# EAGLE design YOTSUBA_+Y+Z_ver.1.1b (EAGLE 9.6.2)
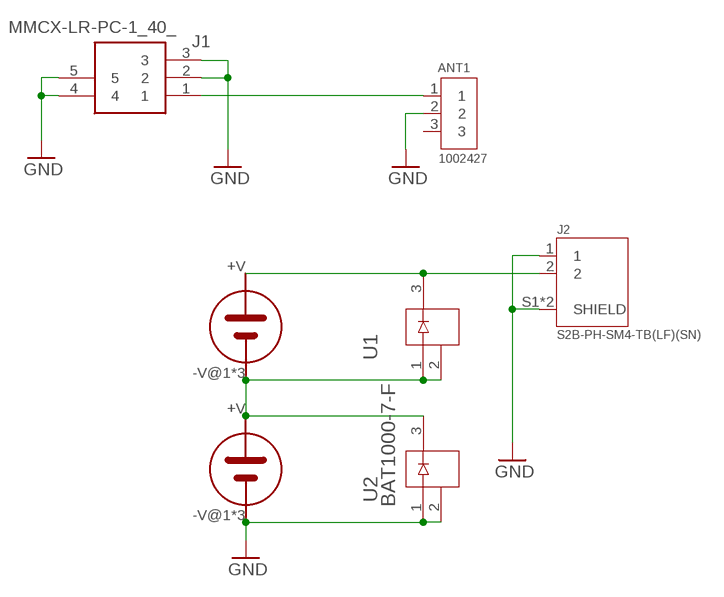
[diagram p0: schematic, sheet 1]

## Parts
ANT1  1002427  [ANTENNA_1002427]
J1  MMCX-LR-PC-1_40_  [MMCXLRPC140]
J2  S2B-PH-SM4-TB(LF)(SN)  [JST_S2B-PH-SM4-TB(LF)(SN)]
U1  BAT1000-7-F  [SOT23_BAT_DIO]
U2  BAT1000-7-F  [SOT23_BAT_DIO]
U$2  3G30A  [SOLAR_3G30A]
U$3  3G30A  [SOLAR_3G30A]

## Nets
GND [GND]: ANT1.2 J1.2 J1.3 J1.4 J1.5 J2.1 J2.S1(SHIELD) J2.S2(SHIELD) U2.1 U2.2 U$3.-V@1(-V) U$3.-V@2(-V) U$3.-V@3(-V)
N$5: U1.1 U1.2 U2.3 U$2.-V@1(-V) U$2.-V@2(-V) U$2.-V@3(-V) U$3.+V
N$6: J2.2 U1.3 U$2.+V
RF2 [ANTENNA]: ANT1.1 J1.1
Unconnected: ANT1.3

## Library data of the parts
ANT1 = 1002427:1002427: RF ANT 868MHZ/915MHZ STAMPED MET; DESCRIPTION: 868MHz, 915MHz, 1.575GHz Beidou, GLONASS, GPS, ISM, LoRa, LPWAN, Sigfox Stamped Metal RF Antenna 868MHz, 915MHz, 1.561GHz ~ 1.602GHz 3dBi Solder Surface Mount; DIGI-KEY_PART_NUMBER: 478-1002427TR-ND; MF: Ethertronics/AVX; MP: 1002427; PACKAGE: None; PURCHASE-URL: https://pricing.snapeda.com/search/part/1002427/?ref=eda
J1 = MMCX-LR-PC-1_40_:MMCX-LR-PC-1_40_: RF Connectors / Coaxial Connectors MINI PUSH-ON CONN RECEPT RA Source: Datasheet <https://componentsearchengine.com/Datasheets/1/MMCX-LR-PC-1(40).pdf>; DESCRIPTION: RF Connectors / Coaxial Connectors MINI PUSH-ON CONN RECEPT RA; HEIGHT: 3.95mm; MANUFACTURER_NAME: Hirose; MANUFACTURER_PART_NUMBER: MMCX-LR-PC-1(40); MOUSER_PART_NUMBER: 798-MMCX-LR-PC-1(40); MOUSER_PRICE-STOCK: https://www.mouser.co.uk/ProductDetail/Hirose-Connector/MMCX-LR-PC-140?qs=XQjbzJWzFPVvtPijmLd%2FXQ%3D%3D
J2 = S2B-PH-SM4-TB_LF__SN_:S2B-PH-SM4-TB(LF)(SN): PH Series 2 Position 2 mm Pitch Surface Mount Side Entry Shrouded Header; DESCRIPTION: Connector Header Surface Mount, Right Angle 2 position 0.079 (2.00mm); DIGI-KEY_PART_NUMBER: 455-1749-2-ND; MF: JST Sales; MP: S2B-PH-SM4-TB(LF)(SN); PACKAGE: None; PURCHASE-URL: https://pricing.snapeda.com/search/part/S2B-PH-SM4-TB(LF)(SN)/?ref=eda
U1 U2 = BAT1000:BAT1000-7-F; COPYRIGHT: Copyright (C) 2023 Ultra Librarian. All rights reserved.; DIGIKEY_PART_NUMBER_1: BAT1000-7FDITR-ND; DIGIKEY_PART_NUMBER_2: BAT1000-7FDICT-ND; DIGIKEY_PART_NUMBER_3: BAT1000-7FDIDKR-ND; MANUFACTURER_PART_NUMBER: BAT1000-7-F; MFR_NAME: Diodes Inc
U$2 U$3 = 3G30A_normal:3G30A

## Net classes
2 GND: clearance 0.5 mm to class 0, clearance 0.21 mm to class 1, clearance 0.5 mm

## Board
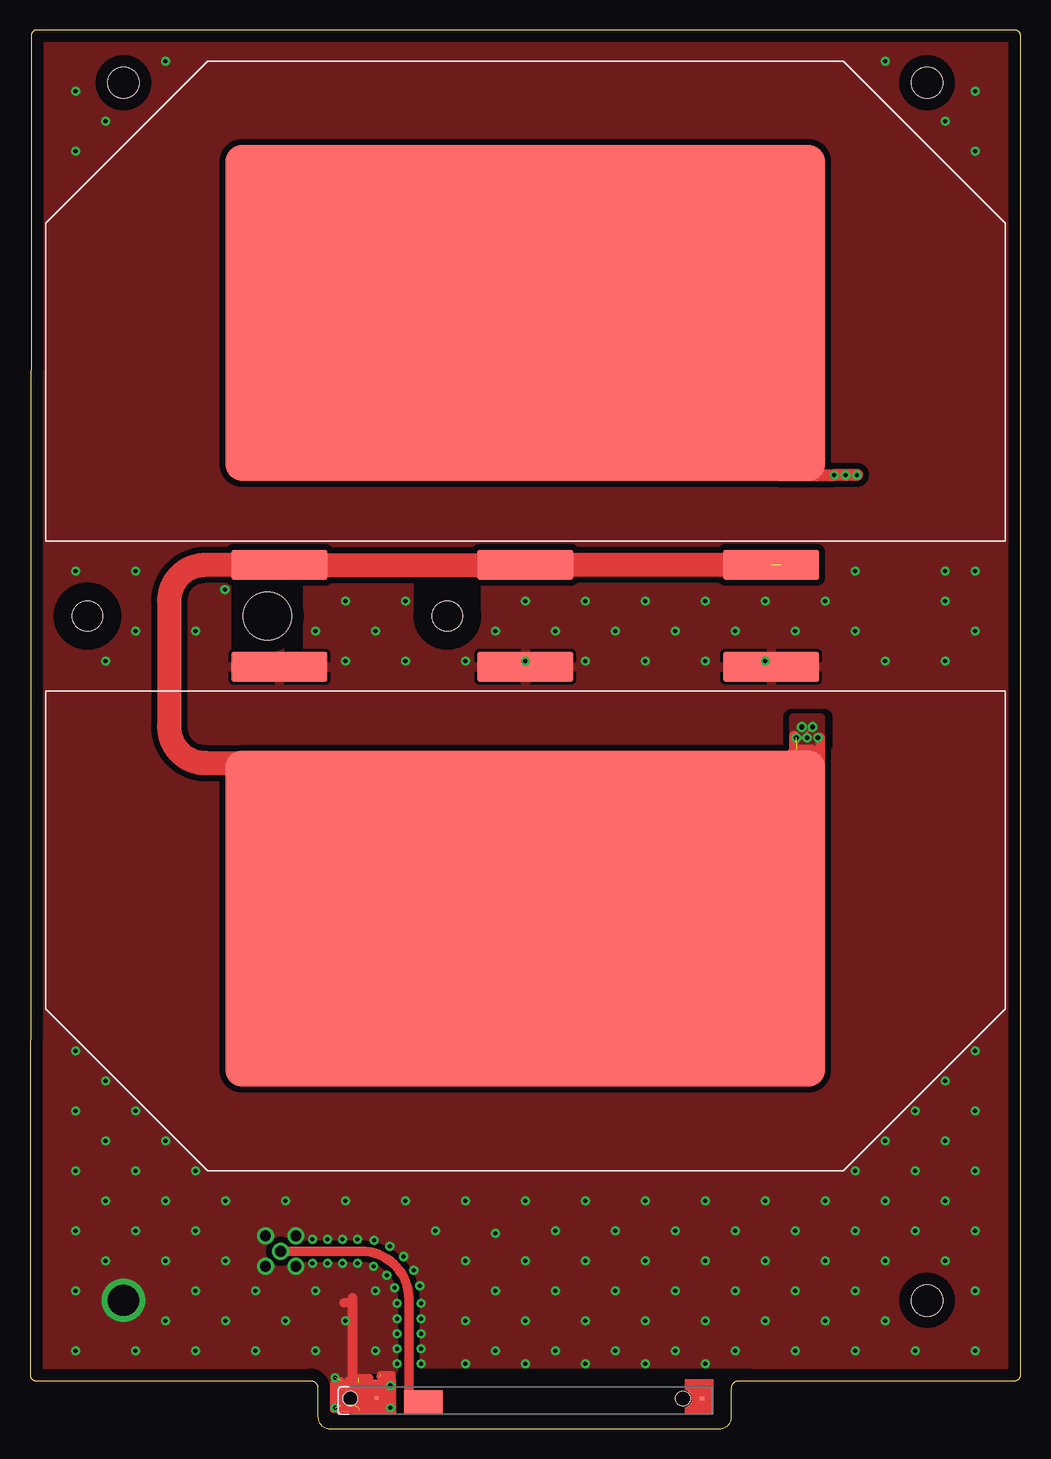
[diagram p1: board, top side]
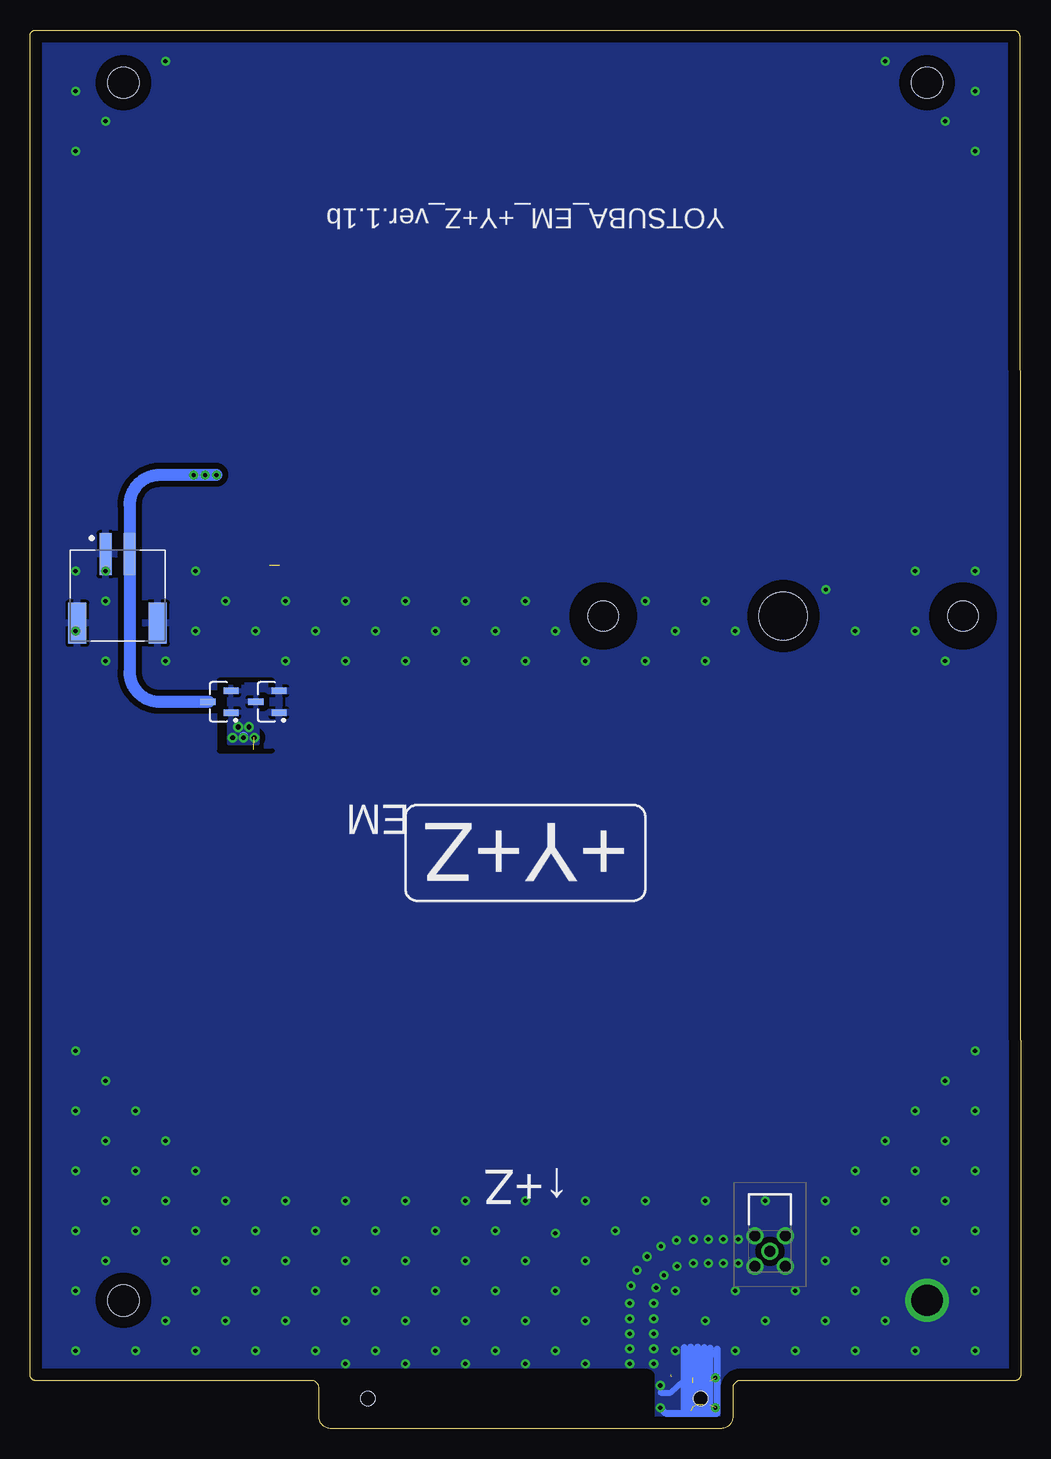
[diagram p2: board, bottom side, seen from below]

Size 82.6 x 116.6 mm. Coordinates in mm from the lower left corner, seen from the top.
Outline: 0.5,4 23.4,4 arc-90 24,3.4 24,1 arc90 25,0 57.5,0 arc90 58.5,1 58.5,3.4 arc-90 59.1,4 82.1,4 arc90 82.6,4.5 82.6,116.1 arc90 82.1,116.6 0.6,116.6 arc90 0.1,116.1 0,4.5 arc90 0.5,4
Copper layers (1*16): Top 0.035mm / dielectric 1.2mm / Bottom 0.035mm
Design rules "default *": minimum track width 6mil, minimum drill 0.35mm, track to track 6mil, track to pad 6mil, pad to pad 6mil, via to via 6mil, smd to smd 6mil, copper to edge 1mm, drill to drill 6mil, minimum pad ring 10mil, minimum via ring 8mil, stop-mask expansion 4mil, vias tented up to drill 30mil, thermal gap 10mil
Holes 2.6 mm at 74.8,10.7 7.8,112.2 74.8,112.2
Holes 4 mm at 19.8,67.75
Holes 2.5 mm at 4.8,67.75 34.8,67.75
tRestrict: area 2.1,65 to 7.5,70.5; area 32.1,65 to 37.5,70.5; 13 lines
bRestrict: area 2.1,65 to 7.5,70.5; area 32.1,65 to 37.5,70.5; 7 lines

### Footprints (pad centres in the part's own frame; a part is rotated, then mirrored left to right if it is on the bottom)
ANTENNA_1002427 = smd 3.2 x 1.9: 1 24.1,-1.05 | smd 0.3 x 0.3: 2 28.02,-1.375; 3 0.875,-1.325 | hole 1.2: 2.46,-1.3; 30.2,-1.3
MMCXLRPC140 = drill 0.9 pad 1.4: 1 0,0; 2 -1.27,-1.27; 3 1.27,-1.27; 4 1.27,1.27; 5 -1.27,1.27
JST_S2B-PH-SM4-TB(LF)(SN) = smd 1 x 3.5: 1 -1,0; 2 1,0 | smd 1.5 x 3.4: S1 -3.35,-5.75; S2 3.35,-5.75
SOT23_BAT_DIO = smd 0.568 x 1.259: 1 -0.915,-0.965; 2 0.915,-0.965; 3 0,0.965
SOLAR_3G30A = smd 50 x 28: +V 0,19 | smd 8 x 2.5: -V@1 -20.5,-2; -V@2 20.5,-2; -V@3 0,-2

### Placement (x,y rotation side)
ANT1  56.9,1.2 180 top
J1  20.9,14.8 90 bottom
J2  75.3,72.9 0 bottom
U1  66.8,60.6 90 bottom
U2  62.8,60.6 90 bottom
U$2  41.3,74 0 top
U$3  41.3,61.5 180 top

### Tracks (layer width: path | path; a pad name or v marks a point on that pad's centre or on a via)
GND  (via drill 0.35, 2.6)  (7 unrouted)
  Top 0.6: ANT1.2 29.4,2.58 29.4,1.75 v30.05,1.75 | v30.05,1.75 29.9,1.6 25.3,1.6 25.3,3.65 | 25.9,1.95 25.9,4 | 26.5,2 26.5,4.05 | 27,2 27,4.05 | 27.35,1.8 27.35,3.85 | v30.05,1.75 30.2,1.91 30.2,4.5 29.2,4.5 | 28.35,4.25 27.35,4.25 | 30.15,4.35 29.15,4.35
  Top 0.8: 26.9,10.5 26.2,10.5 | 26.9,10.9 26.9,10.5 | 26.9,10.5 26.9,3.7 25.4,3.7
  Bottom 0.5: 30,3 29.2,3 25.3,6.62
  Bottom 0.6: v30.05,1.75 29.6,1.3 25.3,1.3 25.3,6.62 | 25.9,1.4 25.9,6.72 | 26.4,1.45 26.4,6.77 | 26.95,1.5 26.95,6.82 | 27.5,1.5 27.5,6.82 | 28.05,1.45 28.05,6.77
  other vias: 78.8,31.5 76.3,29 73.8,26.5 78.8,26.5 76.3,24 71.3,24 68.8,21.5 73.8,21.5 78.8,21.5 71.3,19 76.3,19 78.8,16.5 78.8,11.5 73.8,16.5 68.8,16.5 61.3,14 66.3,14 71.3,14 68.8,11.5 63.8,11.5 66.3,9 71.3,9 46.3,14 41.3,14 38.8,16.3 36.3,14 33.8,16.5 36.3,19 31.3,19 16.3,14 48.8,16.5 51.3,19 13.8,21.5 8.8,21.5 11.3,24 6.3,24 8.8,26.5 6.3,29 3.8,26.5 3.8,31.5 11.3,9 3.8,11.5 7.8,10.7 3.8,21.5 13.8,11.5 11.3,14 6.3,64 61.3,64 76.3,64 78.8,66.5 71.3,64 76.3,69 78.8,71.5 8.8,66.5 8.8,71.5 3.8,71.5 3.8,111.5 6.3,109 11.3,114 71.3,114 78.8,106.5 78.8,111.5 43.8,16.5 26.3,19 21.3,19 13.8,16.5 16.3,19 11.3,19 8.8,16.5 6.3,19 3.8,16.5 6.3,14 3.8,106.5 76.3,109 13.8,66.5 23.8,66.5 28.8,66.5 26.3,69 31.3,69 31.3,64 26.3,64 36.3,64 41.3,64 38.8,66.5 41.3,69 43.8,66.5 46.3,69 48.8,66.5 46.3,64 51.3,64 53.8,66.5 51.3,69 56.3,69 58.8,66.5 56.3,64 61.3,69 63.8,66.5 66.3,69 68.8,66.5 68.8,71.5 76.3,71.5 16.25,69.95 41.3,19 46.3,19 56.3,14 51.3,14 53.8,16.5 56.3,19 58.8,16.5 61.3,19 63.8,16.5 66.3,19 76.3,14 16.3,9 18.8,11.5 21.3,9 23.8,11.5 28.8,11.5 23.55,13.8 24.8,13.8 26.05,13.8 23.55,15.8 24.8,15.8 26.05,15.8 27.3,15.8 38.8,11.5 36.3,9 38.8,6.5 41.3,9 43.8,11.5 48.8,11.5 46.3,9 43.8,6.5 48.8,6.5 51.3,9 53.8,11.5 56.3,9 53.8,6.5 58.8,11.5 61.3,9 58.8,6.5 63.8,6.5 68.8,6.5 73.8,6.5 78.8,6.5 3.8,6.5 13.8,6.5 8.8,6.5 18.8,6.5 23.8,6.5 26.3,9 28.8,6.5 30.05,3.6 25.45,1.75 25.45,4.25 41.3,5.4 36.3,5.4 46.3,5.4 51.3,5.4 56.3,5.4 27.3,13.8 28.65,13.55 28.7,15.7 30,15.2 31.15,14.35 32,13.2 32.5,11.9 29.75,12.8 30.4,11.75 32.6,5.4 30.6,5.4 30.6,6.65 30.6,7.9 30.6,9.15 30.6,10.45 32.6,6.65 32.6,7.9 32.6,9.15 32.6,10.45
  pour Top: -4.35,107.9 arc90 -4.6,107.65 -4.6,-0.85 arc90 -4.05,-1.4 88.9,-1.4 88.9,107.65 arc90 77.65,118.9 -1.35,118.9 -4.35,115.9
  pour Bottom: 89.6,123.7 -8.3,123.7 -8.3,-4.8 89.6,-4.8
N$5  (via drill 0.4)  (2 unrouted)
  Top 0.152: 63.7,55.75 63.08,55.13 | 63.08,55.13 62.97,55.02 53.82,55.02 U$3.+V | 63.08,55.13 63.08,56.33 v65.25,58.5
  Top 0.8: U$3.+V 65.9,42.5 | 63.7,57.6 v63.9,57.6 | v65.7,57.6 65.9,57.6 65.9,55.2 64.6,55.2 | 65.25,56.6 63.95,56.6 | 63.7,57.8 63.7,55.75 63.7,55.4
  Top 2: U$3.+V 41.3,55.5 14.6,55.5 arc-90 11.6,58.5 11.6,69 arc-90 14.6,72 U$2.-V@1 U$2.-V@3 62.6,72
  Bottom 0.8: v64.8,57.6 64.8,57.7
  other vias: 64.35,58.5
  pour Bottom: 66,57.2 63.6,57.2 63.6,61.8 66,61.8
  pour Top: 63.4,54.9 63.4,59.2 arc-90 63.7,59.5 65.9,59.5 arc-90 66.2,59.2 66.2,54.9
  pour Top: 63.4,54.95 63.4,59.25 arc-90 63.7,59.55 65.9,59.55 arc-90 66.2,59.25 66.2,54.95
  pour Top: 63.4,54.95 63.4,59.25 arc-90 63.7,59.55 65.9,59.55 arc-90 66.2,59.25 66.2,54.95
N$6  (via drill 0.35)
  Top 1: 52.45,93 U$2.+V | 61.6,82.1 62.35,82.1 62.35,79.5 v67.05,79.5 v68.95,79.5
  Top 2: U$2.+V 41.36,87.39 41.39,86.78 | 41.39,86.78 41.59,82.5 | 41.39,86.78 42.51,87.9 46.1,87.9 51.9,82.1 61.6,82.1
  Bottom 1: 67.7,60.6 U1.3 71.8,60.6 arc90 74.3,63.1 J2.2 74.3,77 arc90 71.8,79.5 v68.95,79.5 v68,79.5 v67.05,79.5
RF2
  Top 0.8: J1.1 27.6,14.8 arc-90 31.6,10.8 31.6,2.25 ANT1.1
(copper drawn outside any net)
  shapes: Top circle x1

### Text on the board
bNames: YOTSUBA_EM_+Y+Z_ver.1.1b | EM | +Y+Z | ↑+Z